# Altium schematic sheet sar20-baseboard-MCU.SchDoc
size A3
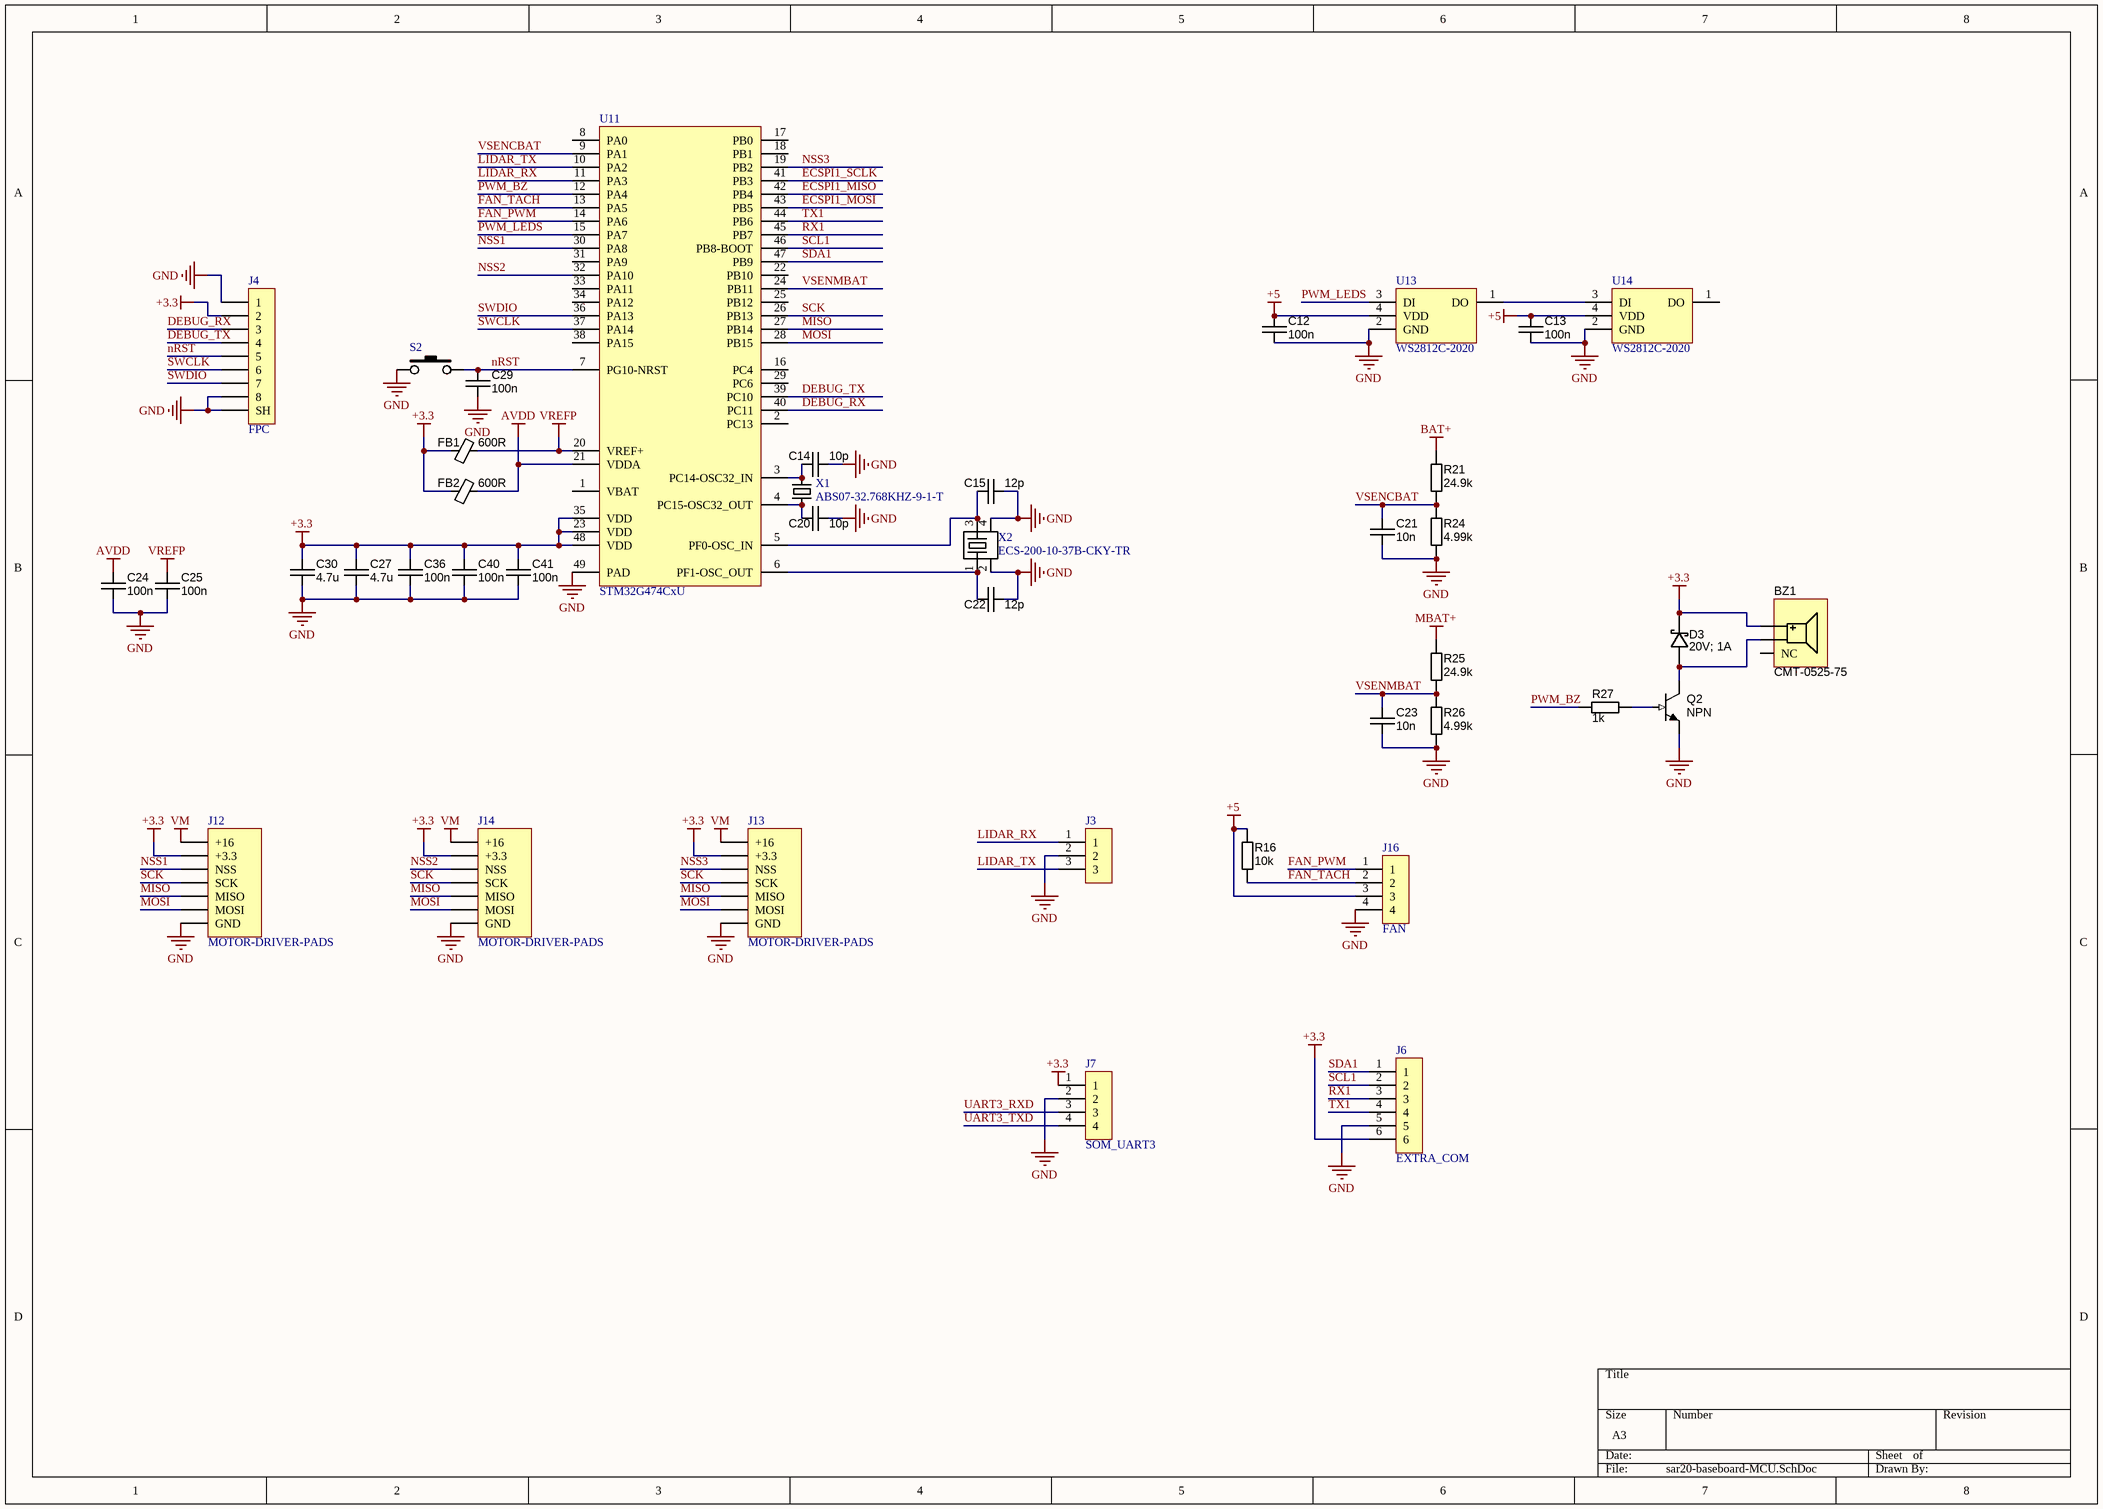
[diagram p0: sar20-baseboard-MCU.SchDoc]

## Parts
BZ1  CMT-0525-75  [CMT-0525-75]
C12  100n  [CAPC1005X55N]
C13  100n  [CAPC1005X55N]
C14  value 10p  [CAPC0603X04N]  (hidden comment: CAPC_100n_0201)
C15  value 12p  [CAPC0603X04N]  (hidden comment: CAPC_100n_0201)
C20  value 10p  [CAPC0603X04N]  (hidden comment: CAPC_100n_0201)
C21  value 10n  [CAPC0603X04N]  (hidden comment: CAPC_100n_0201)
C22  value 12p  [CAPC0603X04N]  (hidden comment: CAPC_100n_0201)
C23  value 10n  [CAPC0603X04N]  (hidden comment: CAPC_100n_0201)
C24  value 100n  [CAPC0603X04N]  (hidden comment: CAPC_100n_0201)
C25  value 100n  [CAPC0603X04N]  (hidden comment: CAPC_100n_0201)
C27  value 4.7u  [CAPC1608X90N]  (hidden comment: approved sub OK)
C29  value 100n  [CAPC0603X04N]  (hidden comment: CAPC_100n_0201)
C30  value 4.7u  [CAPC1608X90N]  (hidden comment: approved sub OK)
C36  100n  [CAPC1005X55N]
C40  100n  [CAPC1005X55N]
C41  100n  [CAPC1005X55N]
D3  20V; 1A  [SOD123]
FB1  value 600R  [INDC1005X06N]  (hidden comment: Ferrite Bead)
FB2  value 600R  [INDC1005X06N]  (hidden comment: Ferrite Bead)
J3  MOLEX_PICOBLADE_530470310  [MOLEX_PICOBLADE_530470310]  (value not drawn)
J4  FPC  [HIROSE-FH19C-8S-0.5SH]
J6  EXTRA_COM  [MOLEX_PICOBLADE_530470610]
J7  SOM_UART3  [MOLEX_PICOBLADE_530470410]
J12  MOTOR-DRIVER-PADS  [MOTOR-DRIVER-PADS]  (no BOM)
J13  MOTOR-DRIVER-PADS  [MOTOR-DRIVER-PADS]  (no BOM)
J14  MOTOR-DRIVER-PADS  [MOTOR-DRIVER-PADS]  (no BOM)
J16  FAN  [MOLEX_PICOBLADE_530470410]
Q2  NPN  [SOT23-3]
R16  value 10k  [RESC1005X40N]  (hidden comment: Thick Film)
R21  value 24.9k  [RESC1005X40N]  (hidden comment: Thick Film)
R24  value 4.99k  [RESC1005X40N]  (hidden comment: Thick Film)
R25  value 24.9k  [RESC1005X40N]  (hidden comment: Thick Film)
R26  value 4.99k  [RESC1005X40N]  (hidden comment: Thick Film)
R27  value 1k  [RESC1005X40N]  (hidden comment: Thick Film)
S2  PUSHBUTTON  [KMR421NGLFS]  (value not drawn)
U11  STM32G474CxU  [QFN50P700X700X60_HS-49N]
U13  WS2812C-2020  [WS2812C-2020]
U14  WS2812C-2020  [WS2812C-2020]
X1  ABS07-32.768KHZ-9-1-T  [XTAL-3.2x1.5]
X2  ECS-200-10-37B-CKY-TR  [XTAL-2.0X1.6]

## Nets
+3.3: BZ1.1(Positive) C27.1 C30.1 C36.1 C40.1 C41.1 D3.K FB1.1 FB2.1 J4.2 J6.6 J7.1 J12.+3.3 J13.+3.3 J14.+3.3 U11.23(VDD) U11.35(VDD) U11.48(VDD)
+5: C12.2 C13.1 J16.3 R16.1 U13.4(VDD) U14.4(VDD)
AVDD: C24.2 FB2.2 U11.21(VDDA)
BAT+: R21.1
GND: C12.1 C13.2 C14.1 C15.1 C20.1 C21.1 C22.1 C23.1 C24.1 C25.1 C27.2 C29.1 C30.2 C36.2 C40.2 C41.2 J3.2 J4.1 J4.8 J4.SH J6.5 J7.2 J12.GND J13.GND J14.GND J16.4 Q2.2(E) R24.2 R26.2 S2.1 U11.49(PAD) U13.2(GND) U14.2(GND) X2.2 X2.4
MBAT+: R25.1
VM: J12.+16 J13.+16 J14.+16
VREFP: C25.2 FB1.2 U11.20(VREF+)
DEBUG_RX: J4.3 U11.40(PC11)
DEBUG_TX: J4.4 U11.39(PC10)
ECSPI1_MISO: U11.42(PB4)
ECSPI1_MOSI: U11.43(PB5)
ECSPI1_SCLK: U11.41(PB3)
FAN_PWM: J16.1 U11.14(PA6)
FAN_TACH: J16.2 R16.2 U11.13(PA5)
LIDAR_RX: J3.1 U11.11(PA3)
LIDAR_TX: J3.3 U11.10(PA2)
MISO: J12.MISO J13.MISO J14.MISO U11.27(PB14)
MOSI: J12.MOSI J13.MOSI J14.MOSI U11.28(PB15)
nRST: C29.2 J4.5 S2.2 U11.7(PG10-NRST)
NSS1: J12.NSS U11.30(PA8)
NSS2: J14.NSS U11.32(PA10)
NSS3: J13.NSS U11.19(PB2)
PWM_BZ: R27.1 U11.12(PA4)
PWM_LEDS: U11.15(PA7) U13.3(DI)
RX1: J6.3 U11.45(PB7)
SCK: J12.SCK J13.SCK J14.SCK U11.26(PB13)
SCL1: J6.2 U11.46(PB8-BOOT)
SDA1: J6.1 U11.47(PB9)
SWCLK: J4.6 U11.37(PA14)
SWDIO: J4.7 U11.36(PA13)
TX1: J6.4 U11.44(PB6)
UART3_RXD: J7.3
UART3_TXD: J7.4
VSENCBAT: C21.2 R21.2 R24.1 U11.9(PA1)
VSENMBAT: C23.2 R25.2 R26.1 U11.24(PB11)
NetBZ1_2: BZ1.2(Negative) D3.A Q2.3(C)
NetC14_2: C14.2 U11.3(PC14-OSC32_IN) X1.2
NetC15_2: C15.2 U11.5(PF0-OSC_IN) X2.3
NetC20_2: C20.2 U11.4(PC15-OSC32_OUT) X1.1
NetC22_2: C22.2 U11.6(PF1-OSC_OUT) X2.1
NetQ2_1: Q2.1(B) R27.2
NetU13_1: U13.1(DO) U14.3(DI)

Not connected (* = marked no-connect by the designer): BZ1 3(NC); U11 1(VBAT) 2(PC13) 8(PA0) 16(PC4) 17(PB0) 18(PB1) 22(PB10) 25(PB12) 29(PC6) 31(PA9) 33(PA11) 34(PA12) 38(PA15); U14 1(DO)

## Library data of the parts
C12 C13 C36 C40 C41 = CAPC_100n_0402_X5R_16V_10%: Capacitor SMD Cer 100nF 10% 16V X5R 0402; Manufacturer 1: AVX Corporation; Manufacturer Part Number 1: 0402YD104KAT2A; Ratings: 16V; X5R; SCDType: spec; Tolerance: ±10%; Operating Temperature: -55°C ~ 125°C; Package / Case: 0402 (1005 Metric); Size / Dimension: 0.039" L x 0.020" W (1.00mm x 0.50mm); Supplier 1: Digi-Key; Supplier Part Number 1: 478-1126-1-ND; ComponentLink1URL: http://www.avx.com/docs/Catalogs/cx5r.pdf; ComponentLink1Description: http://www.avx.com/docs/Catalogs/cx5r.pdf; Supplier 2: Digi-Key; Supplier Part Number 2: 311-1347-1-ND; Manufacturer 2: Yageo; Manufacturer Part Number 2: CC0402KRX5R7BB104; ComponentLink2URL: http://www.yageo.com/documents/recent/UPY-GPHC_X5R_4V-to-50V_12.pdf; ComponentLink2Description: http://www.yageo.com/documents/recent/UPY-GPHC_X5R_4V-to-50V_12.pdf; Value: 100n
C27 C30 = CAPC_2u2_0603_10V_10%: Capacitor SMD Cer 2.2uF 10% 10V X5R 0603; Manufacturer 1: AVX Corporation; Manufacturer Part Number 1: 0603ZD225KAT2A; Ratings: 10V; X5R; Material: ceramic; SCDType: spec; Package / Case: 0603 (1608 metric); Tolerance: ±10%; Supplier 1: Digi-Key; Supplier Part Number 1: 478-6212-1-ND; ComponentLink1URL: http://www.avx.com/docs/Catalogs/cx5r.pdf; ComponentLink1Description: http://www.avx.com/docs/Catalogs/cx5r.pdf
D3 = DIODE_SCHOTTKY_40V_1A: Diode Schottky SMD 20V 1A SOD123; Manufacturer 1: Diodes Inc; Manufacturer Part Number 1: 1N5819HW-7-F; Ratings: 40V; 1A; Material: Si; SCDType: spec; Package / Case: SOD123; Diode Type: Schottky; Mounting Type: Surface Mount; Supplier 1: Digi-Key; Supplier Part Number 1: 1N5819HW-FDICT-ND
FB1 FB2 = FERRITE_BEAD
J4 = FPC-CONNECTOR-8
J6 = MOLEX_PICOBLADE_530470610
J7 J16 = MOLEX_PICOBLADE_530470410
Q2 = NPN_FMMT617TA: Transistor SMD NPN 15V 3A SOT-23; Manufacturer 1: Diodes/Zetex; Ratings: 15V; 3A; 625mW; SCDType: spec; Supplier 1: Digi-Key; Supplier Part Number 1: FMMT617CT-ND; Package / Case: SOT-23; Manufacturer Part Number 1: FMMT617TA
R16 R21 R24-R27 = RES_10K_0402_1%: Resistor SMD chip 10k Ohm 0.063W 1% 0402; Manufacturer 1: Vishay Dale; Manufacturer Part Number 1: CRCW040210K0FKED; Ratings: 1/16 W; SCDType: spec; Package / Case: 0402 (1005 Metric); Manufacturer 2: Yageo; Manufacturer Part Number 2: RC0402FR-0710KL; Supplier 1: Digi-Key; Supplier Part Number 1: 541-10.0KLCT-ND; ComponentLink1URL: http://www.vishay.com/doc?20035; ComponentLink1Description: http://www.vishay.com/doc?20035; Supplier 2: Digi-Key; Supplier Part Number 2: 311-10.0KLRCT-ND; ComponentLink2URL: http://www.yageo.com/documents/recent/PYu-RC0402_51_RoHS_L_6.pdf; ComponentLink2Description: http://www.yageo.com/documents/recent/PYu-RC0402_51_RoHS_L_6.pdf; Tolerance: ±1%
X1 = XTAL-3.2x1.5
X2 = XTAL-2.0x1.6